# EAGLE design gb_usb_programmer (EAGLE 9.4.0)
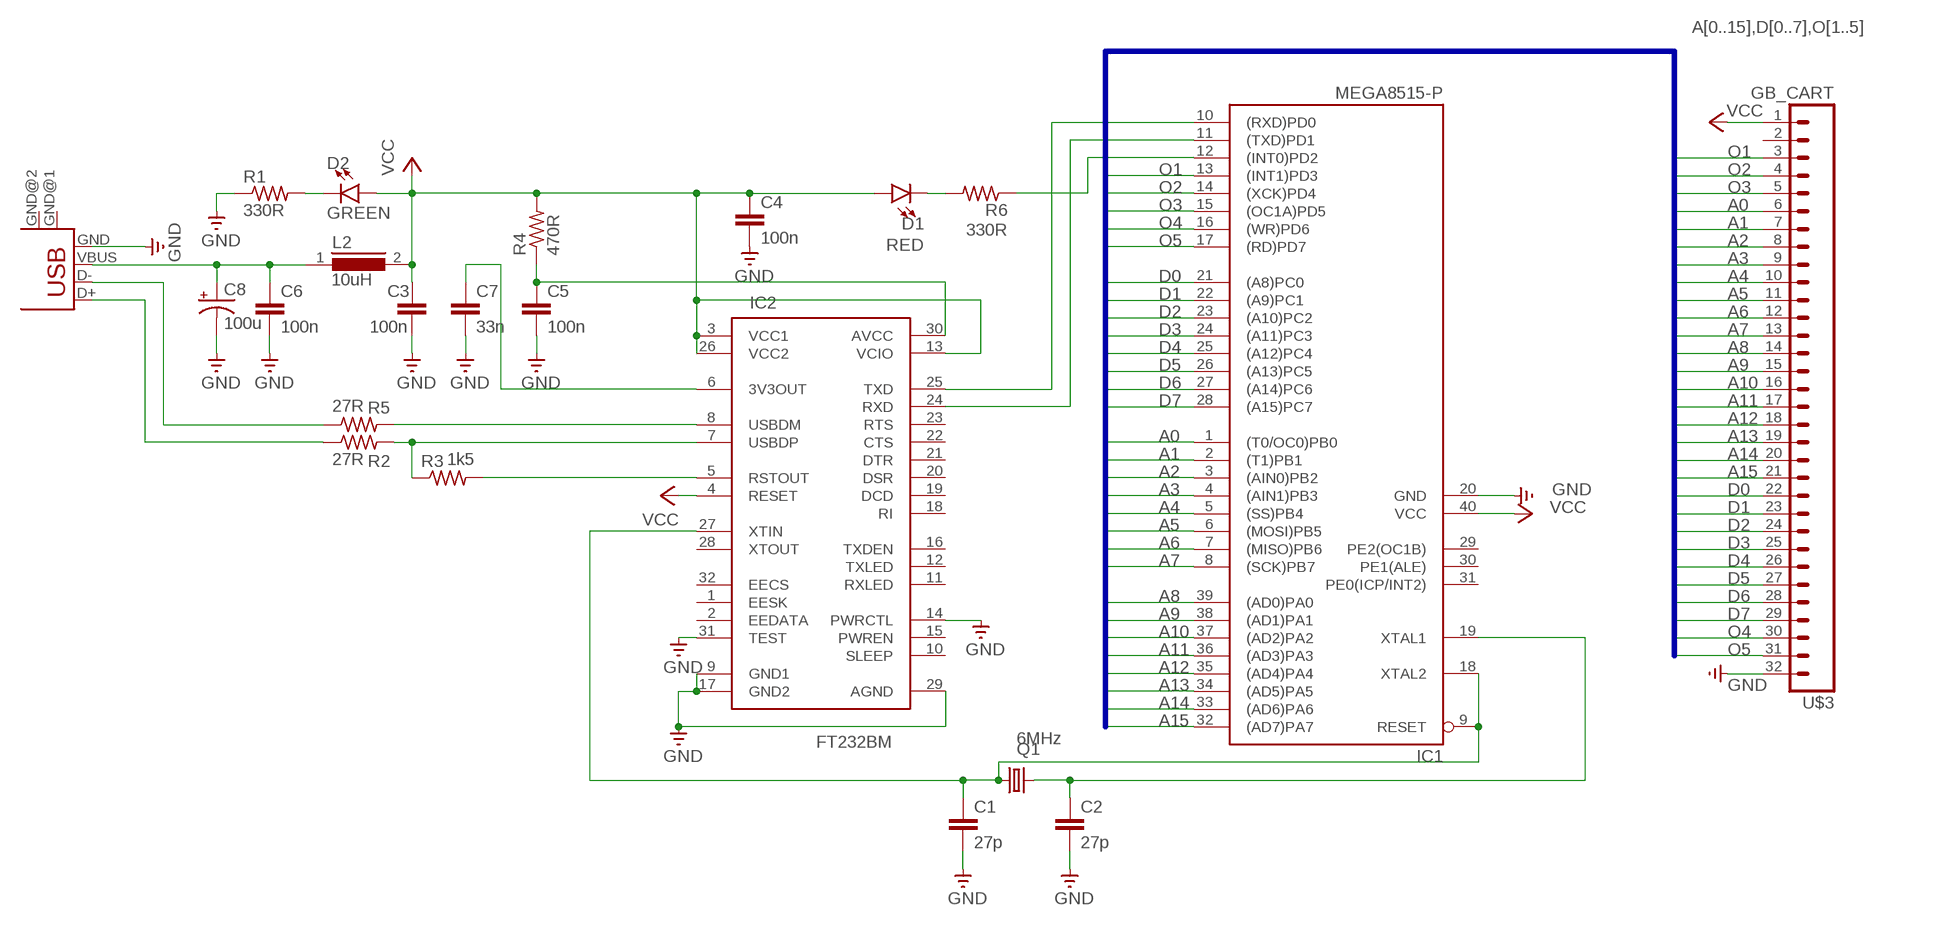
[diagram p0: schematic, sheet 1]

## Parts
C1  27p  C5/2.5  [C5B2.5]
C2  27p  C5/2.5  [C5B2.5]
C3  100n  C5/2.5  [C5B2.5]
C4  100n  C5/2.5  [C5B2.5]
C5  100n  C5/2.5  [C5B2.5]
C6  100n  C5/2.5  [C5B2.5]
C7  33n  C5/2.5  [C5B2.5]
C8  100u  CPOL-USE1.8-4  [E1,8-4]
D1  RED  LED5MM-KIT  [LED_5MM-KIT]
D2  GREEN  LED5MM-KIT  [LED_5MM-KIT]
IC1  MEGA8515-P  [DIL40]
IC2  FT232BM  [QFP-32]
L2  10uH  82114R  [82114R]
Q1  6MHz  CRYSTALHC49S  [HC49/S]
R1  330R  R-US_0207/10  [0207/10]
R2  27R  R-US_0207/10  [0207/10]
R3  1k5  R-US_0207/10  [0207/10]
R4  470R  R-US_0207/10  [0207/10]
R5  27R  R-US_0207/10  [0207/10]
R6  330R  R-US_0207/10  [0207/10]
U$3  GB_CART  M32GB  [1X32_GB]
USB1  USB-B-H  [USB-B-H]

## Nets
A0: IC1.1((T0/OC0)PB0) U$3.6
A1: IC1.2((T1)PB1) U$3.7
A2: IC1.3((AIN0)PB2) U$3.8
A3: IC1.4((AIN1)PB3) U$3.9
A4: IC1.5((SS)PB4) U$3.10
A5: IC1.6((MOSI)PB5) U$3.11
A6: IC1.7((MISO)PB6) U$3.12
A7: IC1.8((SCK)PB7) U$3.13
A8: IC1.39((AD0)PA0) U$3.14
A9: IC1.38((AD1)PA1) U$3.15
A10: IC1.37((AD2)PA2) U$3.16
A11: IC1.36((AD3)PA3) U$3.17
A12: IC1.35((AD4)PA4) U$3.18
A13: IC1.34((AD5)PA5) U$3.19
A14: IC1.33((AD6)PA6) U$3.20
A15: IC1.32((AD7)PA7) U$3.21
D0: IC1.21((A8)PC0) U$3.22
D1: IC1.22((A9)PC1) U$3.23
D2: IC1.23((A10)PC2) U$3.24
D3: IC1.24((A11)PC3) U$3.25
D4: IC1.25((A12)PC4) U$3.26
D5: IC1.26((A13)PC5) U$3.27
D6: IC1.27((A14)PC6) U$3.28
D7: IC1.28((A15)PC7) U$3.29
GND: C1.2 C2.2 C3.2 C4.2 C5.2 C6.2 C7.2 C8.- IC1.20(GND) IC2.9(GND1) IC2.14(PWRCTL) IC2.17(GND2) IC2.29(AGND) IC2.31(TEST) R1.1 U$3.32 USB1.GND
N$1: D1.K(C) R6.2
N$2: D2.K(C) R1.2
N$3: C6.1 C8.+ L2.1 USB1.VBUS
N$4: C5.1 IC2.30(AVCC) R4.1
N$5: R2.1 USB1.D+
N$6: R5.1 USB1.D-
N$7: IC2.7(USBDP) R2.2 R3.1
N$8: IC2.8(USBDM) R5.2
N$9: IC2.5(RSTOUT) R3.2
N$10: C7.1 IC2.6(3V3OUT)
N$11: C2.1 IC1.19(XTAL1) Q1.2
N$12: C1.1 IC1.9(RESET) IC1.18(XTAL2) IC2.27(XTIN) Q1.1
N$13: IC1.10((RXD)PD0) IC2.25(TXD)
N$14: IC1.11((TXD)PD1) IC2.24(RXD)
N$15: IC1.12((INT0)PD2) R6.1
O1: IC1.13((INT1)PD3) U$3.3
O2: IC1.14((XCK)PD4) U$3.4
O3: IC1.15((OC1A)PD5) U$3.5
O4: IC1.16((WR)PD6) U$3.30
O5: IC1.17((RD)PD7) U$3.31
VCC: C3.1 C4.1 D1.A D2.A IC1.40(VCC) IC2.3(VCC1) IC2.4(RESET) IC2.13(VCIO) IC2.26(VCC2) L2.2 R4.2 U$3.1
Unconnected: IC1.29(PE2(OC1B)) IC1.30(PE1(ALE)) IC1.31(PE0(ICP/INT2)) IC2.1(EESK) IC2.2(EEDATA) IC2.10(SLEEP) IC2.11(RXLED) IC2.12(TXLED) IC2.15(PWREN) IC2.16(TXDEN) IC2.18(RI) IC2.19(DCD) IC2.20(DSR) IC2.21(DTR) IC2.22(CTS) IC2.23(RTS) IC2.28(XTOUT) IC2.32(EECS) U$3.2 USB1.GND@1(GND) USB1.GND@2(GND)

## Buses
A[0..15],D[0..7],O[1..5]

## Library data of the parts
C1-C7 = capacitor-wima:C: CAPACITOR naming: grid - package width
C8 = adafruit:CPOL-US: POLARIZED CAPACITOR, American symbol
D1 D2 = SparkFun-LED:LED: LED (Generic) Standard schematic elements and footprints for 5mm, 3mm, 1206, and 0603 sized LEDs. Generic LEDs with no color specified.
IC1 = atmel:MEGA8515-P: MICROCONTROLLER 8 Kbytes FLASH 512 bytes SRAM 512 bytes EEPROM USART 8-channel 10 bit ADC Source: avr.lbr; MPN: ATMEGA8515-16PU; OC_FARNELL: 9171401; OC_NEWARK: 01M6905
IC2 = ftdi2:FT232BM: FT232BM USB-RS232 Wandler FTDI
L2 = inductors:82114R: INDUCTOR; SPICEPREFIX: L
Q1 = adafruit:CRYSTAL: CRYSTAL; OC_FARNELL: 1667008; OC_NEWARK: unknown
R1-R6 = adafruit:R-US_: RESISTOR, American symbol
U$3 = SparkFun:M32
USB1 = con-usb-2:USB: USB Connectors

## Board
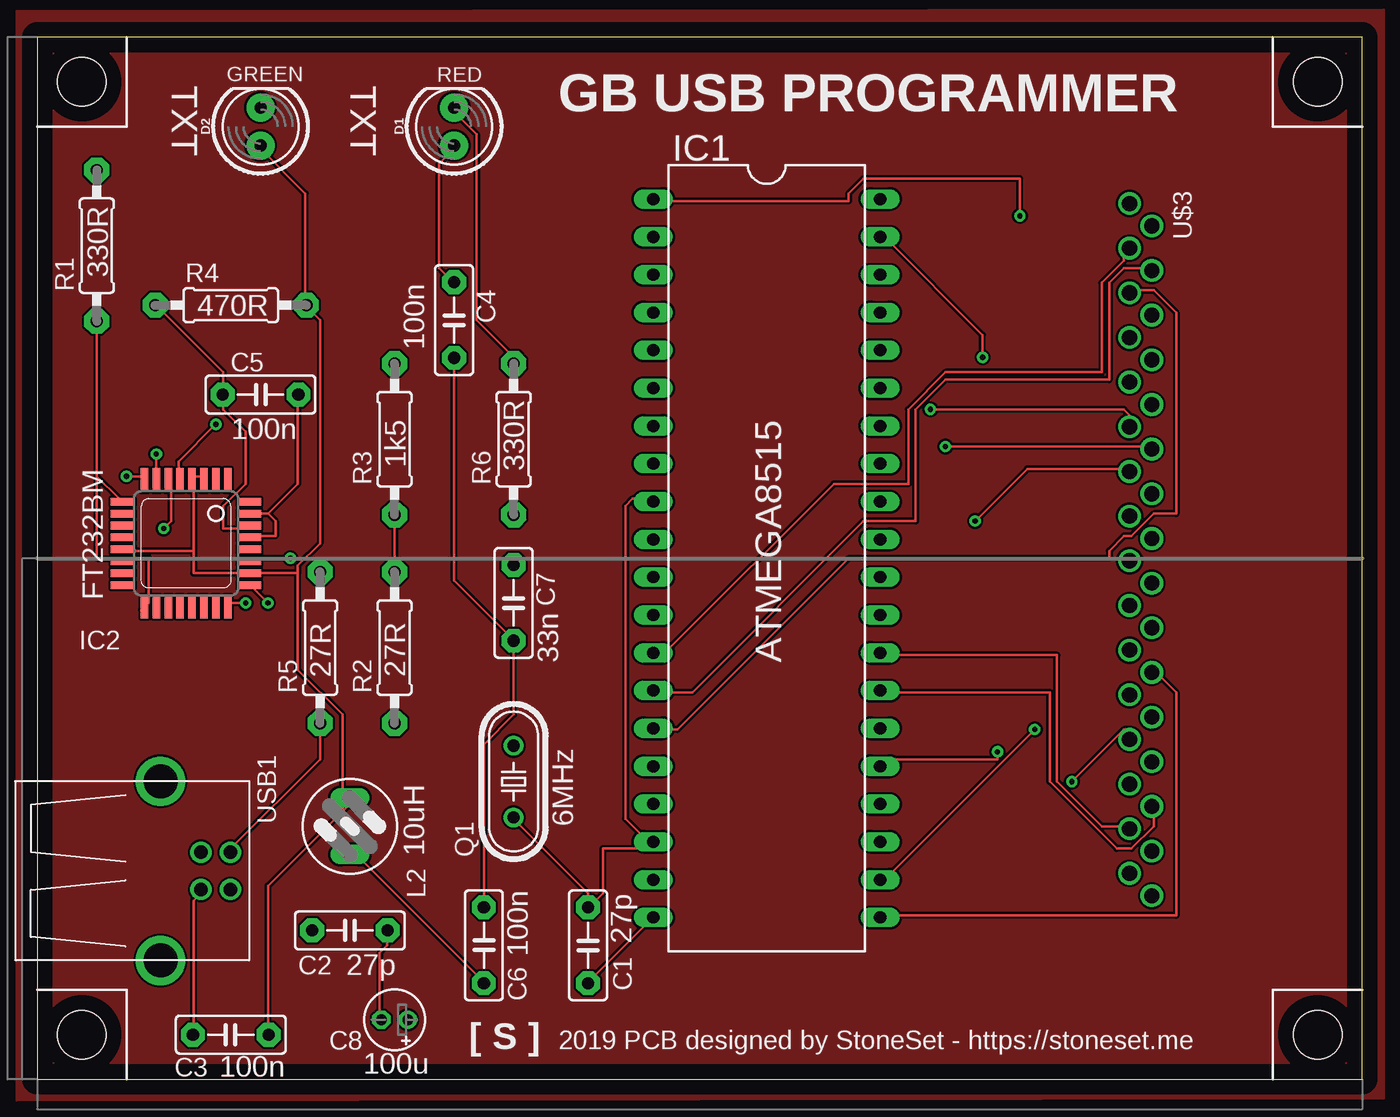
[diagram p1: board, top side]
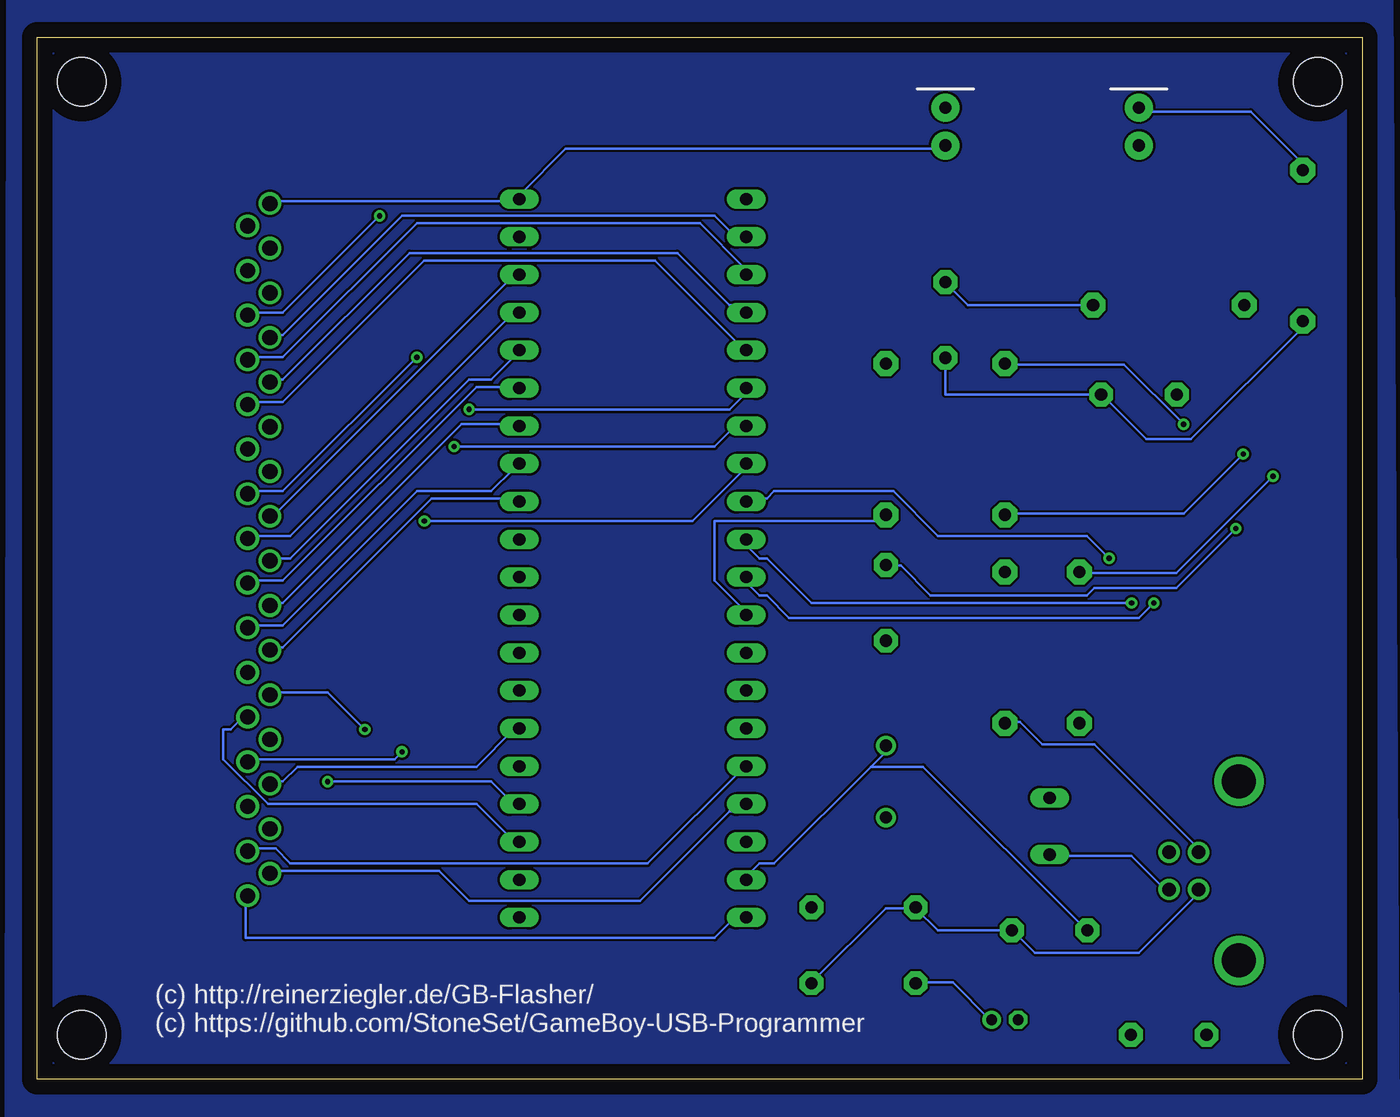
[diagram p2: board, bottom side, seen from below]

Size 89 x 70 mm. Coordinates in mm from the lower left corner, seen from the top.
Outline: 0,0 89,0 89,70 0,70 0,0
Copper layers (1*16): Top 0.035mm / dielectric 1.5mm / Bottom 0.035mm
Design rules "default": minimum track width 6mil, minimum drill 0.35mm, track to track 6mil, track to pad 6mil, pad to pad 6mil, via to via 6mil, smd to smd 6mil, copper to edge 40mil, drill to drill 6mil, minimum pad ring 10mil, minimum via ring 8mil, stop-mask expansion 4mil, vias tented up to drill 0mil, thermal gap 10mil
Holes 3.25 mm at 3,3 86,3 86,67 3,67

### Footprints (pad centres in the part's own frame; a part is rotated, then mirrored left to right if it is on the bottom)
C5B2.5 = drill 0.813 pad 1.6 octagon: 1 -2.54,0; 2 2.54,0
E1,8-4 = drill 0.711 pad 1.168: + -0.889,0 | drill 0.711 pad 1.168 octagon: - 0.889,0
LED_5MM-KIT = drill 0.813 pad 1.88: A -1.27,0; K 1.27,0
DIL40 = drill 0.813 long: 1 -24.13,-7.62; 2 -21.59,-7.62; 3 -19.05,-7.62; 4 -16.51,-7.62; 5 -13.97,-7.62; 6 -11.43,-7.62; 7 -8.89,-7.62; 8 -6.35,-7.62; 9 -3.81,-7.62; 10 -1.27,-7.62; 11 1.27,-7.62; 12 3.81,-7.62; 13 6.35,-7.62; 14 8.89,-7.62; 15 11.43,-7.62; 16 13.97,-7.62; 17 16.51,-7.62; 18 19.05,-7.62; 19 21.59,-7.62; 20 24.13,-7.62; 21 24.13,7.62; 22 21.59,7.62; 23 19.05,7.62; 24 16.51,7.62; 25 13.97,7.62; 26 11.43,7.62; 27 8.89,7.62; 28 6.35,7.62; 29 3.81,7.62; 30 1.27,7.62; 31 -1.27,7.62; 32 -3.81,7.62; 33 -6.35,7.62; 34 -8.89,7.62; 35 -11.43,7.62; 36 -13.97,7.62; 37 -16.51,7.62; 38 -19.05,7.62; 39 -21.59,7.62; 40 -24.13,7.62
QFP-32 = smd 0.508 x 1.6: 1 -2.8,-4.25; 2 -2,-4.25; 3 -1.2,-4.25; 4 -0.4,-4.25; 5 0.4,-4.25; 6 1.2,-4.25; 7 2,-4.25; 8 2.8,-4.25; 17 2.8,4.25; 18 2,4.25; 19 1.2,4.25; 20 0.4,4.25; 21 -0.4,4.25; 22 -1.2,4.25; 23 -2,4.25; 24 -2.8,4.25 | smd 1.6 x 0.508: 9 4.25,-2.8; 10 4.25,-2; 11 4.25,-1.2; 12 4.25,-0.4; 13 4.25,0.4; 14 4.25,1.2; 15 4.25,2; 16 4.25,2.8; 25 -4.25,2.8; 26 -4.25,2; 27 -4.25,1.2; 28 -4.25,0.4; 29 -4.25,-0.4; 30 -4.25,-1.2; 31 -4.25,-2; 32 -4.25,-2.8
82114R = drill 0.813 long: 1 0,1.905; 2 0,-1.905
HC49/S = drill 0.813: 1 -2.413,0; 2 2.413,0
0207/10 = drill 0.813 pad 1.676 octagon: 1 -5.08,0; 2 5.08,0
1X32_GB = drill 1.016 pad 1.422: 1 -1.5,-1.5; 2 0,0; 3 1.5,-1.5; 4 3,0; 5 4.5,-1.5; 6 6,0; 7 7.5,-1.5; 8 9,0; 9 10.5,-1.5; 10 12,0; 11 13.5,-1.5; 12 15,0; 13 16.5,-1.5; 14 18,0; 15 19.5,-1.5; 16 21,0; 17 22.5,-1.5; 18 24,0; 19 25.5,-1.5; 20 27,0; 21 28.5,-1.5; 22 30,0; 23 31.5,-1.5; 24 33,0; 25 34.5,-1.5; 26 36,0; 27 37.5,-1.5; 28 39,0; 29 40.5,-1.5; 30 42,0; 31 43.5,-1.5; 32 45,0
USB-B-H = drill 0.914: D+ 0,1.25; D- 1.981,1.25; GND 0,-1.25; VBUS 1.981,-1.25 | drill 2.286: GND@1 -2.718,6.02; GND@2 -2.718,-6.02

### Placement (x,y rotation side)
C1  37,9 270 top
C2  21,10 0 top
C3  13,3 180 top
C4  28,51 270 top
C5  15,46 0 top
C6  30,9 90 top
C7  32,32 270 top
C8  24,4 180 top
D1  28,64 90 top
D2  15,64 90 top
IC1  49,35 270 top
IC2  10,36 180 top
L2  21,17 180 top
Q1  32,20 90 top
R1  4,56 90 top
R2  24,29 90 top
R3  24,43 90 top
R4  13,52 0 top
R5  19,29 90 top
R6  32,43 90 top
U$3  74.87,57.33 270 top
USB1  11,14 0 top

### Tracks (layer width: path | path; a pad name or v marks a point on that pad's centre or on a via)
A0  (via drill 0.35)
  Top 0.152: v66,58 66,60.5 55.5,60.5 54.5,59.5 54.5,59 41.5,59 IC1.1
  Bottom 0.152: v66,58 72.5,51.5 74.5,51.5 U$3.6
A1
  Bottom 0.152: IC1.2 41.5,57 42.5,57 43.5,58 64.5,58 72.5,50 73,50 U$3.7
A2
  Bottom 0.152: IC1.3 41.5,54.5 44.5,57.5 63.5,57.5 72.5,48.5 74.5,48.5 U$3.8
A3
  Bottom 0.152: IC1.4 41.5,52 42.5,52 46,55.5 64,55.5 72.5,47 73,47 U$3.9
A4
  Bottom 0.152: IC1.5 41.5,49 47.5,55 63,55 72.5,45.5 74.5,45.5 U$3.10
A5  (via drill 0.35)
  Top 0.152: v60,45 73,45 73.5,44.5 73.5,44 U$3.11
  Bottom 0.152: v60,45 42.5,45 41.5,46 IC1.6
A6  (via drill 0.35)
  Top 0.152: v61,42.5 74.5,42.5 U$3.12
  Bottom 0.152: v61,42.5 43.5,42.5 42.5,43.5 41.5,43.5 IC1.7
A7  (via drill 0.35)
  Top 0.152: v63,37.5 66.5,41 73,41 U$3.13
  Bottom 0.152: v63,37.5 45,37.5 41.5,41 IC1.8
A8  (via drill 0.35)
  Top 0.152: v63.5,48.5 63.5,50 57,56.5 IC1.39
  Bottom 0.152: v63.5,48.5 72.5,39.5 74.5,39.5 U$3.14
A9
  Bottom 0.152: IC1.38 57,54 73,38 U$3.15
A10
  Bottom 0.152: IC1.37 57,51.5 72,36.5 74.5,36.5 U$3.16
A11
  Bottom 0.152: IC1.36 57,48.5 58.5,47 60,47 72,35 73,35 U$3.17
A12
  Bottom 0.152: IC1.35 57,46.5 59.5,46.5 72.5,33.5 74.5,33.5 U$3.18
A13
  Bottom 0.152: IC1.34 57,44 60.5,44 72.5,32 73,32 U$3.19
A14
  Bottom 0.152: IC1.33 57,41 58.5,39.5 63.5,39.5 72.5,30.5 74.5,30.5 U$3.20
A15
  Bottom 0.152: IC1.32 57,39 62.5,39 72.5,29 73,29 U$3.21
D0
  Top 0.152: IC1.21 57,11 76.5,11 76.5,26 75,27.5 U$3.22
D1  (via drill 0.35)
  Top 0.152: v67,23.5 57,13.5 IC1.22
  Bottom 0.152: v67,23.5 69.5,26 73,26 U$3.23
D2
  Bottom 0.152: IC1.23 57,16 59.5,18.5 73.5,18.5 76.5,21.5 76.5,23.5 76,23.5 75.5,24 75,24 U$3.24
D3  (via drill 0.35)
  Top 0.152: v69.5,20 73,23.5 73.5,23.5 73.5,23 U$3.25
  Bottom 0.152: v69.5,20 58.5,20 57,18.5 IC1.24
D4  (via drill 0.35)
  Top 0.152: v64.5,22 64.5,21.5 57,21.5 IC1.25
  Bottom 0.152: v64.5,22 65,21.5 74.5,21.5 U$3.26
D5
  Bottom 0.152: IC1.26 57,23.5 59.5,21 71.5,21 72.5,20 73,20 U$3.27
D6
  Top 0.152: IC1.27 57,26 68,26 68,20 72.5,15.5 73.5,15.5 75,17 75,18 U$3.28
D7
  Top 0.152: IC1.28 57,28.5 68.5,28.5 68.5,20 71.5,17 73,17 U$3.29
GND
  Top 0.152: IC1.20 41,10.5 37,6.5 C1.2 | IC2.17 7,31.5 7.5,32 7.5,35 6,35 IC2.14 5.5,35 4,35 4,40.5 | 4,40.5 5.5,39 IC2.9 | R1.1 4,40.5 | 15.5,38 16,37.5 16,36.5 14.5,36.5 IC2.29 | IC2.31 15.5,38 | 15.5,38 17.5,40 17.5,46 C5.2 | USB1.GND 11,12.5 10.5,12 10.5,3 C3.2 | C8.- 23,4 23,8.5 23.5,9 23.5,10 C2.2 | C6.2 30,22.5 32,24.5 C7.2 32,29.5 28,33.5 C4.2
  Bottom 0.152: U$3.32 75,12 75,9.5 43.5,9.5 42.5,10.5 41.5,10.5 IC1.20 | C4.2 28,46 C5.2 17.5,46 14.5,43 11.5,43 4,50.5 R1.1 | 30,11.5 28.5,10 C2.2 23.5,10 22,8.5 15,8.5 11,12.5 USB1.GND | 30,11.5 32,11.5 37,6.5 C1.2 | 30,11.5 C6.2
GND1
  pour Bottom: -2.46,-2.93 91.1,-2.81 91,73 -2,73
N$1
  Top 0.152: D1.K 28,64.5 28.5,64.5 29.5,63.5 29.5,51 32,48.5 R6.2
N$2
  Bottom 0.152: R1.2 4,61.5 7.5,65 15,65 D2.K
N$3
  Top 0.152: C6.1 30,6.5 21,15.5 L2.1
  Bottom 0.152: C8.+ 25,4 27.5,6.5 30,6.5 C6.1 | L2.1 21,15 15.5,15 13.5,13 13,13 USB1.VBUS
N$4
  Top 0.152: 12.5,46 12.5,45 14,43.5 14,40 12.5,38.5 12.5,37 14,37 IC2.30 | 12.5,46 12.5,47.5 8,52 R4.1 | 12.5,46 C5.1
N$5
  Bottom 0.152: USB1.D+ 11,15.5 18,22.5 21.5,22.5 23,24 24,24 R2.1
N$6
  Top 0.152: R5.1 19,21.5 13,15.5 USB1.D-
N$7  (via drill 0.35)
  Top 0.152: v8,42 IC2.7 | R3.1 R2.2
  Bottom 0.152: v8,42 12,38 24,38 R3.1
N$8  (via drill 0.35)
  Top 0.152: v6,40.5 7,40.5 IC2.8
  Bottom 0.152: v6,40.5 12.5,34 19,34 R5.2
N$9  (via drill 0.35)
  Top 0.152: v12,44 9.5,41.5 9.5,40.5 IC2.5
  Bottom 0.152: v12,44 16,48 24,48 R3.2
N$10  (via drill 0.35)
  Top 0.152: v8.5,37 9,37.5 9,40 IC2.6
  Bottom 0.152: v8.5,37 12.5,33 18,33 18.5,32.5 29,32.5 31,34.5 32,34.5 C7.1
N$11
  Bottom 0.152: 33,21 39.5,14.5 40.5,14.5 41.5,13.5 IC1.19 | 33,21 32,22 Q1.2 | 33,21 29.5,21 18.5,10 C2.1
N$12  (via drill 0.35)
  Top 0.152: Q1.1 32,17.5 37,12.5 C1.1 37,11.5 38,12.5 38,15.5 41,15.5 IC1.18 41,16 39.5,17.5 39.5,38.5 40,39 41,39 IC1.9 | v17,35 14.5,35 IC2.27
  Bottom 0.152: v17,35 18.5,36.5 28.5,36.5 31.5,39.5 39.5,39.5 40,39 41,39 IC1.9
N$13  (via drill 0.35)
  Top 0.152: v15.5,32 14.5,33 IC2.25
  Bottom 0.152: v15.5,32 37,32 40,35 40.5,35 41.5,36 IC1.10
N$14  (via drill 0.35)
  Top 0.152: v14,32 13,32 IC2.24
  Bottom 0.152: v14,32 15,31 38.5,31 40,32.5 40.5,32.5 41.5,33.5 IC1.11
N$15
  Bottom 0.152: IC1.12 41.5,31.5 43.5,33.5 43.5,37.5 32,37.5 R6.1
O1
  Top 0.152: IC1.13 41.5,29 42.5,29 53.5,40 58.5,40 58.5,45 61,47.5 71.5,47.5 71.5,53.5 73,55 73,55.5 U$3.3
O2
  Top 0.152: IC1.14 41.5,26 44,26 55.5,37.5 59,37.5 59,45 61,47 72,47 72,53.5 73,54.5 74.5,54.5 U$3.4
O3
  Top 0.152: IC1.15 41.5,23.5 43,23.5 54.5,35 72,35 72,35.5 73,36.5 73.5,36.5 75,38 76.5,38 76.5,51.5 75,53 73.5,53 U$3.5
O4
  Bottom 0.152: IC1.16 41.5,21 48,14.5 72,14.5 73,15.5 74.5,15.5 U$3.30
O5
  Bottom 0.152: IC1.17 41.5,18 42.5,18 48.5,12 60,12 62,14 73,14 U$3.31
VCC
  Top 0.152: 10.5,35.5 6,35.5 IC2.13 | 10.5,35.5 10.5,40 IC2.4 10.5,40.5 11,40.5 IC2.3 | 10.5,35.5 10.5,34 IC2.26 17.5,34 | 20.5,18 15.5,13 15.5,3 C3.1 | 20.5,18 21,18.5 L2.2 | 17.5,34 17.5,27.5 20.5,24.5 20.5,18 | D2.A 15,62.5 18,59.5 18,52 R4.2 18.5,52 18.5,51.5 19,51 19,36 17.5,34.5 17.5,34 | D1.A 28,62.5 27,61.5 27,54.5 28,53.5 C4.1
  Bottom 0.152: U$3.1 73,59 57,59 IC1.40 56.5,59.5 53.5,62.5 28,62.5 D1.A | R4.2 26.5,52 28,53.5 C4.1
VCC1
  pour Top: -1.36,-1.39 90.45,-1.28 90.45,71.85 -1.36,71.74

### Text on the board
tPlace: GREEN | RED | GB USB PROGRAMMER | TXT | TXT | 330R | 470R | 100n | 100n | FT232BM | 1k5 | 330R | 33n | ATMEGA8515 | 27R | 27R | 6MHz | 10uH | 27p | 100n | 27p | 100u | [ S ] | 2019 PCB designed by StoneSet - https://stoneset.me | 100n
bPlace: (c) http://reinerziegler.de/GB-Flasher/ / (c) https://github.com/StoneSet/GameBoy-USB-Programmer